# Altium project MotionDetector.PrjPcb
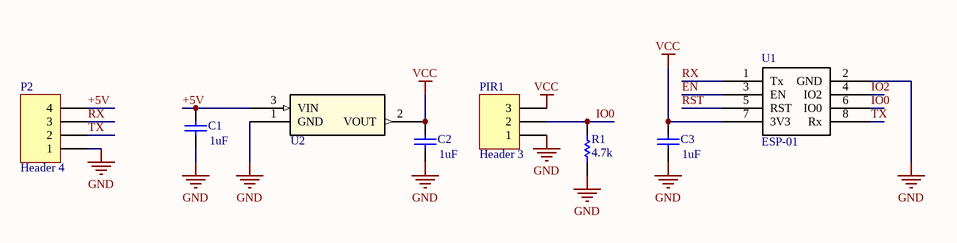
[diagram p0: MotionDetector.SchDoc]
1 sheet, 8 parts. Net scope: global (net labels, ports and power ports of the same name join across sheets).
Board file: MotionDetectorPCB.PcbDoc

## Sheet MotionDetector.SchDoc
size A4

### Parts
C1  value 1uF  [CAP_0804]  (hidden comment: Cap)
C2  value 1uF  [CAP_0804]  (hidden comment: Cap)
C3  value 1uF  [CAP_0804]  (hidden comment: Cap)
P2  Header 4  [HDR1X4]
PIR1  Header 3  [HDR1X3]
R1  value 4.7k  [RES_0804_panasonic]  (hidden comment: Res1)
U1  ESP-01  [ESP-01]
U2  Voltage Reg  [SOT-23]  (value not drawn)

### Nets
GND: C1.1 C2.1 C3.1 P2.1 PIR1.1 R1.1 U1.2(GND) U2.1(GND)
VCC: C2.2 C3.2 PIR1.3 U1.7(3V3) U2.2(VOUT)
+5V: C1.2 P2.4 U2.3(VIN)
EN: U1.3(EN)
IO0: PIR1.2 R1.2 U1.6(IO0)
IO2: U1.4(IO2)
RST: U1.5(RST)
RX: P2.3 U1.1(Tx)
TX: P2.2 U1.8(Rx)

### Library data of the parts
C1-C3 = Cap: Capacitor; Published: 8-Jun-2000; LatestRevisionDate: 17-Jul-2002; LatestRevisionNote: Re-released for DXP Platform.; PackageReference: RAD-0.3; Publisher: Altium Limited; PackageDescription: Radial Cap, Thru-Hole; 2 Leads; 0.3 in Pin Spacing
P2 = Header 4: Header, 4-Pin; LatestRevisionDate: 17-Jul-2002; LatestRevisionNote: Re-released for DXP Platform.; Publisher: Altium Limited
PIR1 = Header 3: Header, 3-Pin; LatestRevisionDate: 17-Jul-2002; LatestRevisionNote: Re-released for DXP Platform.; Publisher: Altium Limited
R1 = Res1: Resistor; Published: 8-Jun-2000; LatestRevisionDate: 17-Jul-2002; LatestRevisionNote: Re-released for DXP Platform.; PackageReference: AXIAL-0.3; Publisher: Altium Limited; PackageDescription: Axial Device, Thru-Hole; 2 Leads; 0.3 in Pin Spacing
U2 = AP2120N-3.3TRG1: Vendor: Diodes Inc; Built_By: EMA_UL_Team; Manufacturer_Part_Number: AP2120N-3.3TRG1; RefDes: RefDes; Type: DEV; Value: Value